# EAGLE design 549-teletouch (EAGLE 8.0.0)
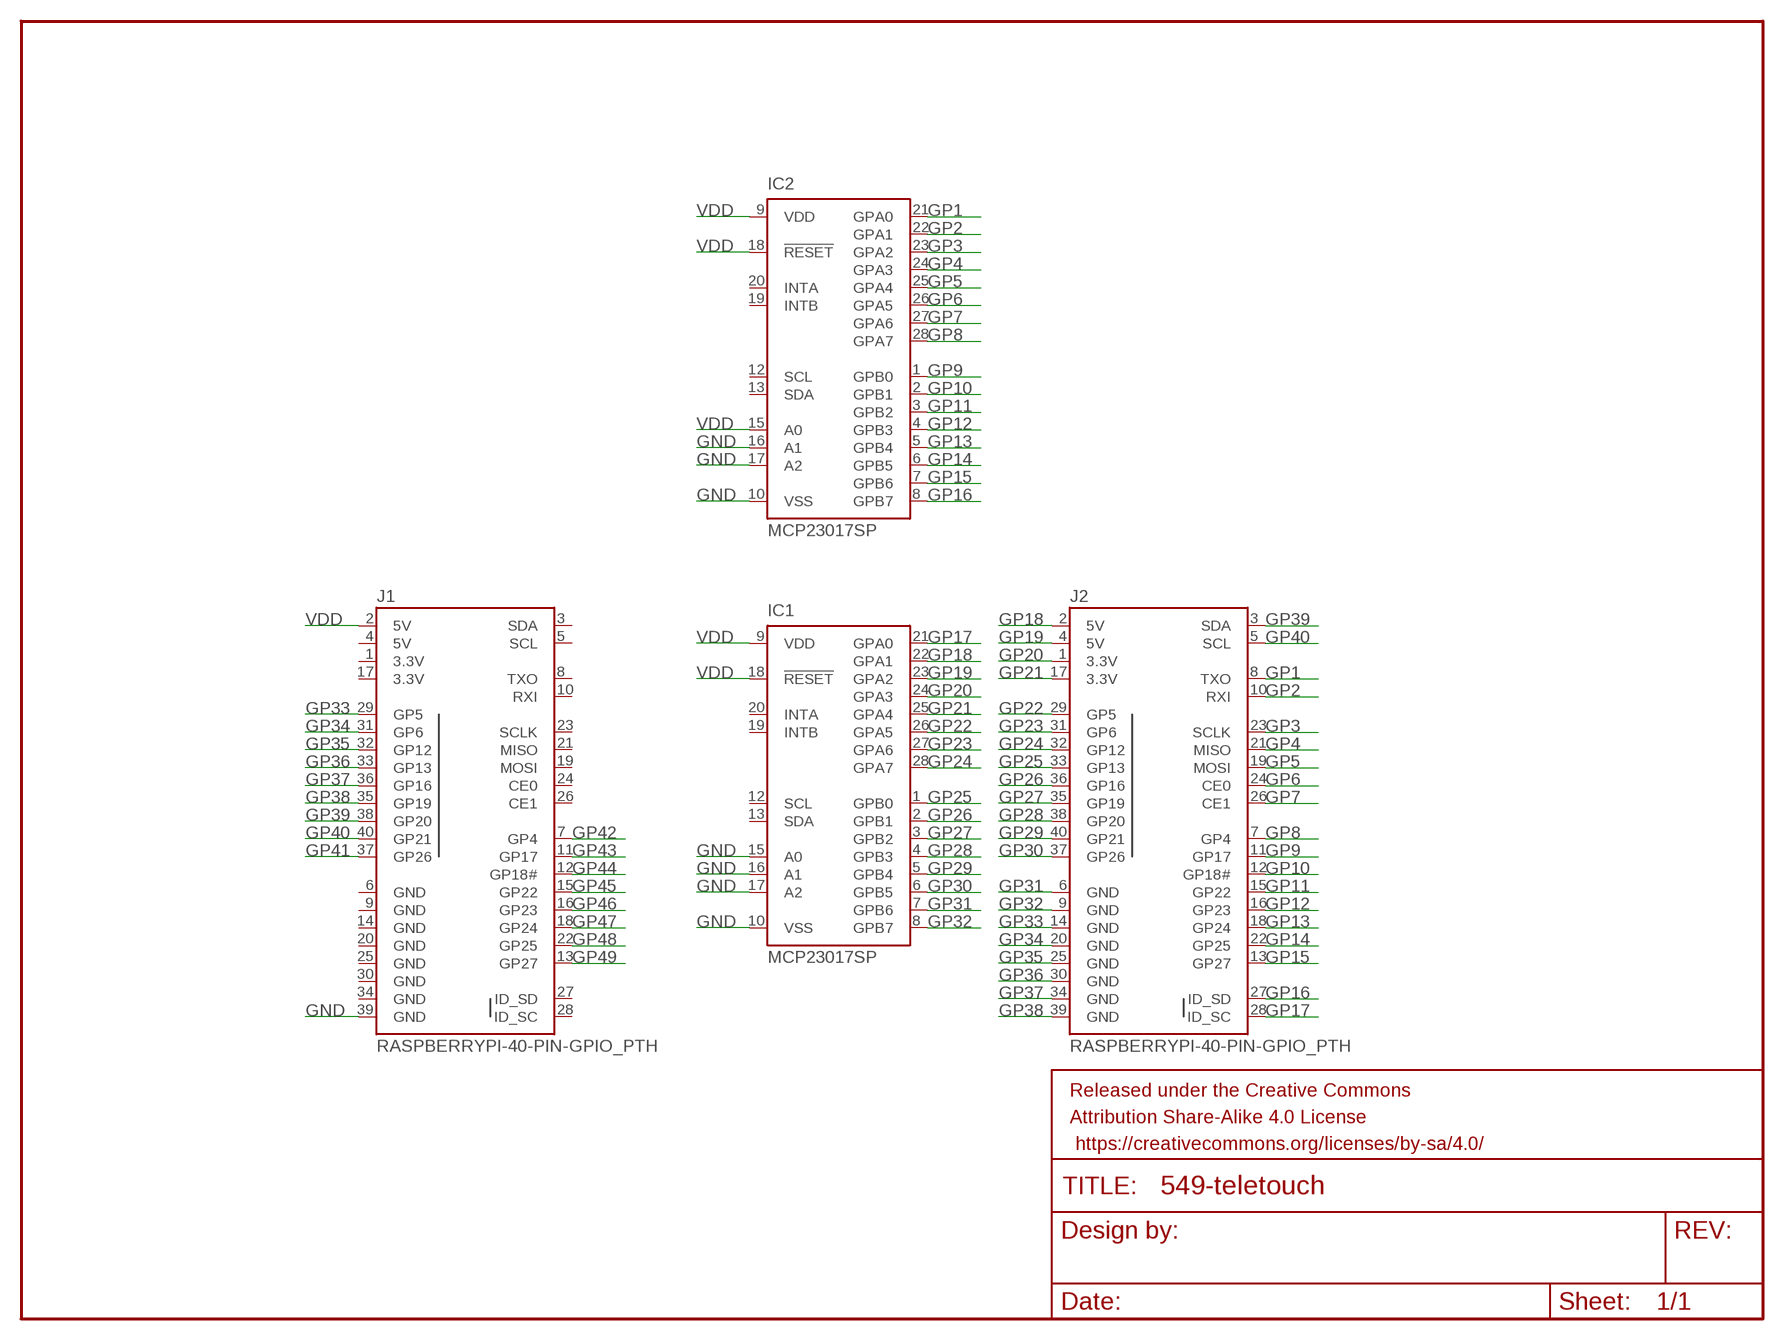
[diagram p0: schematic, sheet 1]

## Parts
FRAME1  FRAME-LETTER  [CREATIVE_COMMONS]
IC1  MCP23017SP  [DIL28-3]
IC2  MCP23017SP  [DIL28-3]
J1  RASPBERRYPI-40-PIN-GPIO_PTH  [2X20_SHROUDED]
J2  RASPBERRYPI-40-PIN-GPIO_PTH  [2X20_SHROUDED]

## Nets
GND: IC1.10(VSS) IC1.15(A0) IC1.16(A1) IC1.17(A2) IC2.10(VSS) IC2.16(A1) IC2.17(A2) J1.39(GND)
GP1: IC2.21(GPA0) J2.8(TXO)
GP2: IC2.22(GPA1) J2.10(RXI)
GP3: IC2.23(GPA2) J2.23(SCLK)
GP4: IC2.24(GPA3) J2.21(MISO)
GP5: IC2.25(GPA4) J2.19(MOSI)
GP6: IC2.26(GPA5) J2.24(CE0)
GP7: IC2.27(GPA6) J2.26(CE1)
GP8: IC2.28(GPA7) J2.7(GP4)
GP9: IC2.1(GPB0) J2.11(GP17)
GP10: IC2.2(GPB1) J2.12(GP18#)
GP11: IC2.3(GPB2) J2.15(GP22)
GP12: IC2.4(GPB3) J2.16(GP23)
GP13: IC2.5(GPB4) J2.18(GP24)
GP14: IC2.6(GPB5) J2.22(GP25)
GP15: IC2.7(GPB6) J2.13(GP27)
GP16: IC2.8(GPB7) J2.27(ID_SD)
GP17: IC1.21(GPA0) J2.28(ID_SC)
GP18: IC1.22(GPA1) J2.2(5V)
GP19: IC1.23(GPA2) J2.4(5V)
GP20: IC1.24(GPA3) J2.1(3.3V)
GP21: IC1.25(GPA4) J2.17(3.3V)
GP22: IC1.26(GPA5) J2.29(GP5)
GP23: IC1.27(GPA6) J2.31(GP6)
GP24: IC1.28(GPA7) J2.32(GP12)
GP25: IC1.1(GPB0) J2.33(GP13)
GP26: IC1.2(GPB1) J2.36(GP16)
GP27: IC1.3(GPB2) J2.35(GP19)
GP28: IC1.4(GPB3) J2.38(GP20)
GP29: IC1.5(GPB4) J2.40(GP21)
GP30: IC1.6(GPB5) J2.37(GP26)
GP31: IC1.7(GPB6) J2.6(GND)
GP32: IC1.8(GPB7) J2.9(GND)
GP33: J1.29(GP5) J2.14(GND)
GP34: J1.31(GP6) J2.20(GND)
GP35: J1.32(GP12) J2.25(GND)
GP36: J1.33(GP13) J2.30(GND)
GP37: J1.36(GP16) J2.34(GND)
GP38: J1.35(GP19) J2.39(GND)
GP39: J1.38(GP20) J2.3(SDA)
GP40: J1.40(GP21) J2.5(SCL)
GP41: J1.37(GP26)
GP42: J1.7(GP4)
GP43: J1.11(GP17)
GP44: J1.12(GP18#)
GP45: J1.15(GP22)
GP46: J1.16(GP23)
GP47: J1.18(GP24)
GP48: J1.22(GP25)
GP49: J1.13(GP27)
VDD: IC1.9(VDD) IC1.18(!RESET) IC2.9(VDD) IC2.15(A0) IC2.18(!RESET) J1.2(5V)
Unconnected: IC1.12(SCL) IC1.13(SDA) IC1.19(INTB) IC1.20(INTA) IC2.12(SCL) IC2.13(SDA) IC2.19(INTB) IC2.20(INTA) J1.3(SDA) J1.5(SCL) J1.8(TXO) J1.10(RXI) J1.19(MOSI) J1.21(MISO) J1.23(SCLK) J1.24(CE0) J1.26(CE1) J1.27(ID_SD) J1.28(ID_SC)

## Power pins joined to a net without a drawn wire
3.3V: J1.1(3.3V) J1.17(3.3V)
5V: J1.4(5V)
GND: J1.6(GND) J1.9(GND) J1.14(GND) J1.20(GND) J1.25(GND) J1.30(GND) J1.34(GND)

## Library data of the parts
FRAME1 = SparkFun-Aesthetics:FRAME-LETTER: Schematic Frame - Letter Standard 8.5x11 US Letter frame
IC1 IC2 = microchip:MCP23017: http://ww1.microchip.com/downloads/en/DeviceDoc/21952a.pdf Source: http://ww1.microchip.com/downloads/en/DeviceDoc/21952a.pdf; MF: MICROCHIP; MPN: MCP23017-E/SP; OC_FARNELL: 1332088; OC_NEWARK: 31K2959
J1 J2 = SparkFun-Connectors:RASPBERRYPI-40-PIN-GPIO: Raspberry Pi GPIO Header 2x20 pin connector, as found on B, B+, A+ models. Both shrouded PTH and SMT versions available. SparkFun Products: GPIO Shrouded Header <https://www.sparkfun.com/products/13054>- PTH SparkFun Pi Wedge (Preassembled) <https://www.sparkfun.com/products/13717>; PROD_ID: CONN-12263; SF_ID: PRT-13054

## Board
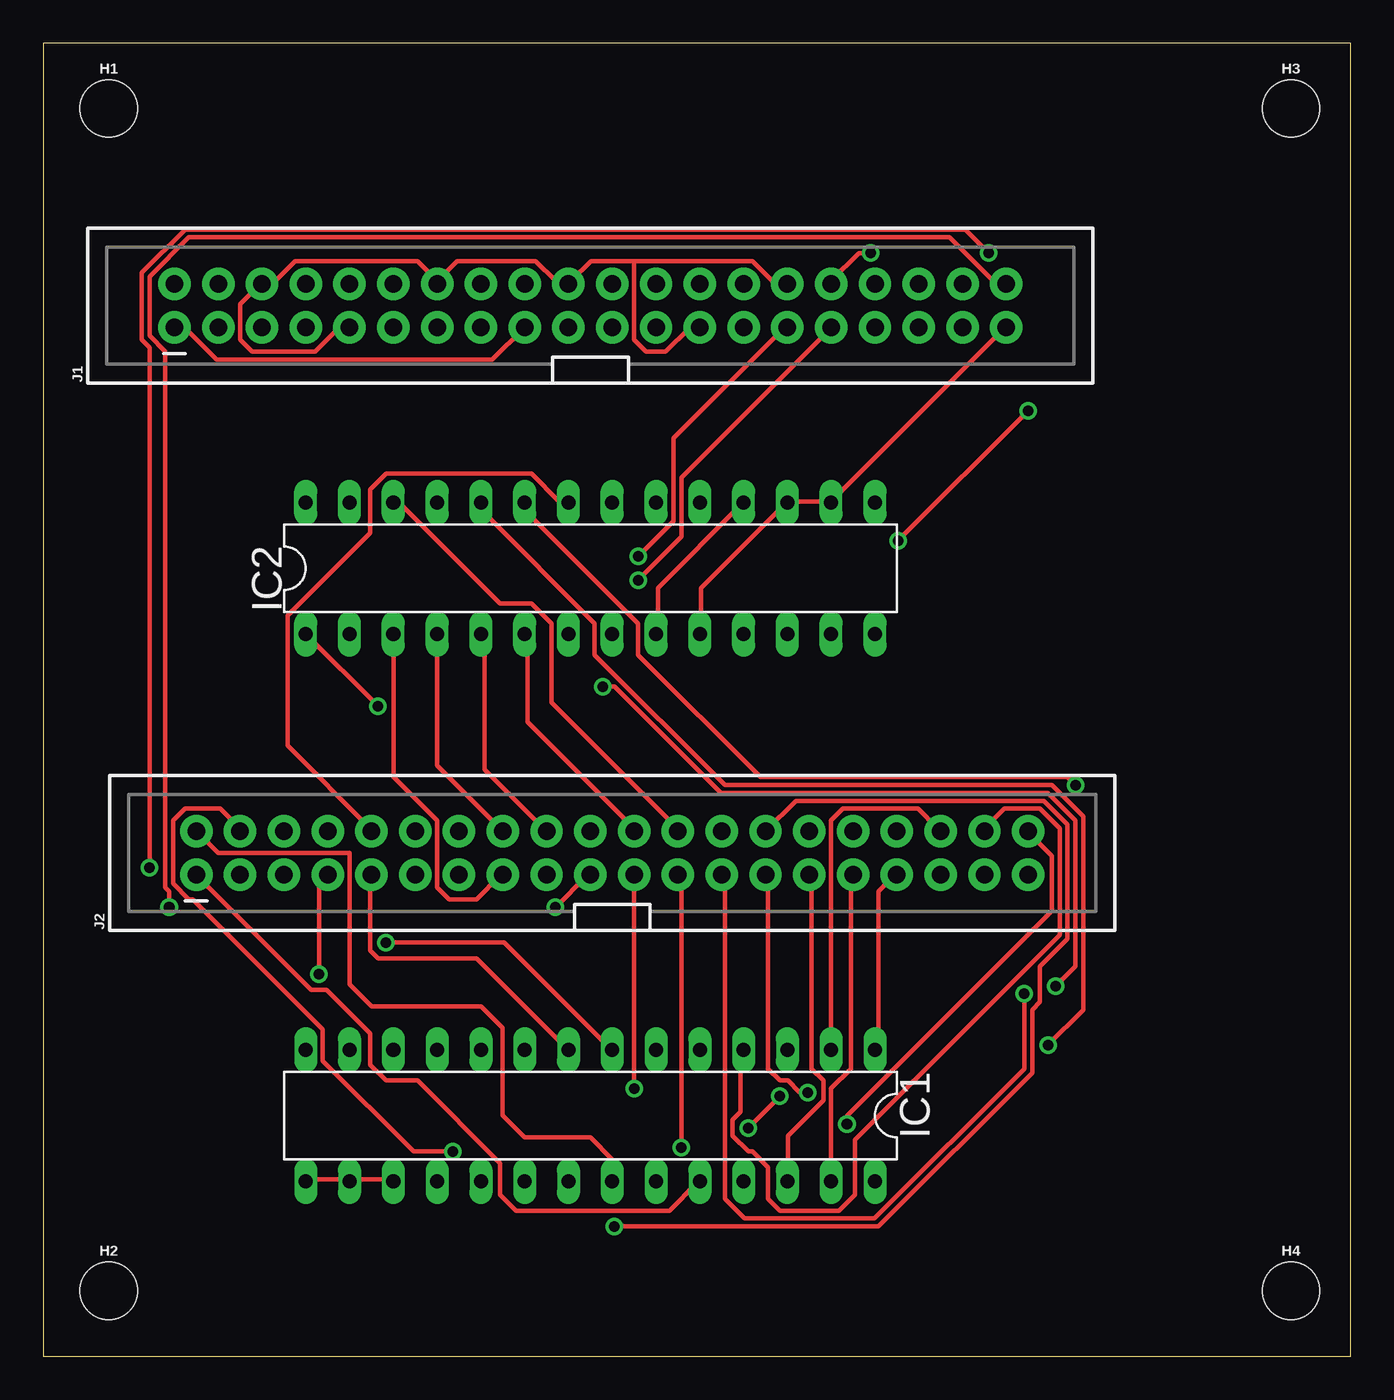
[diagram p1: board, top side]
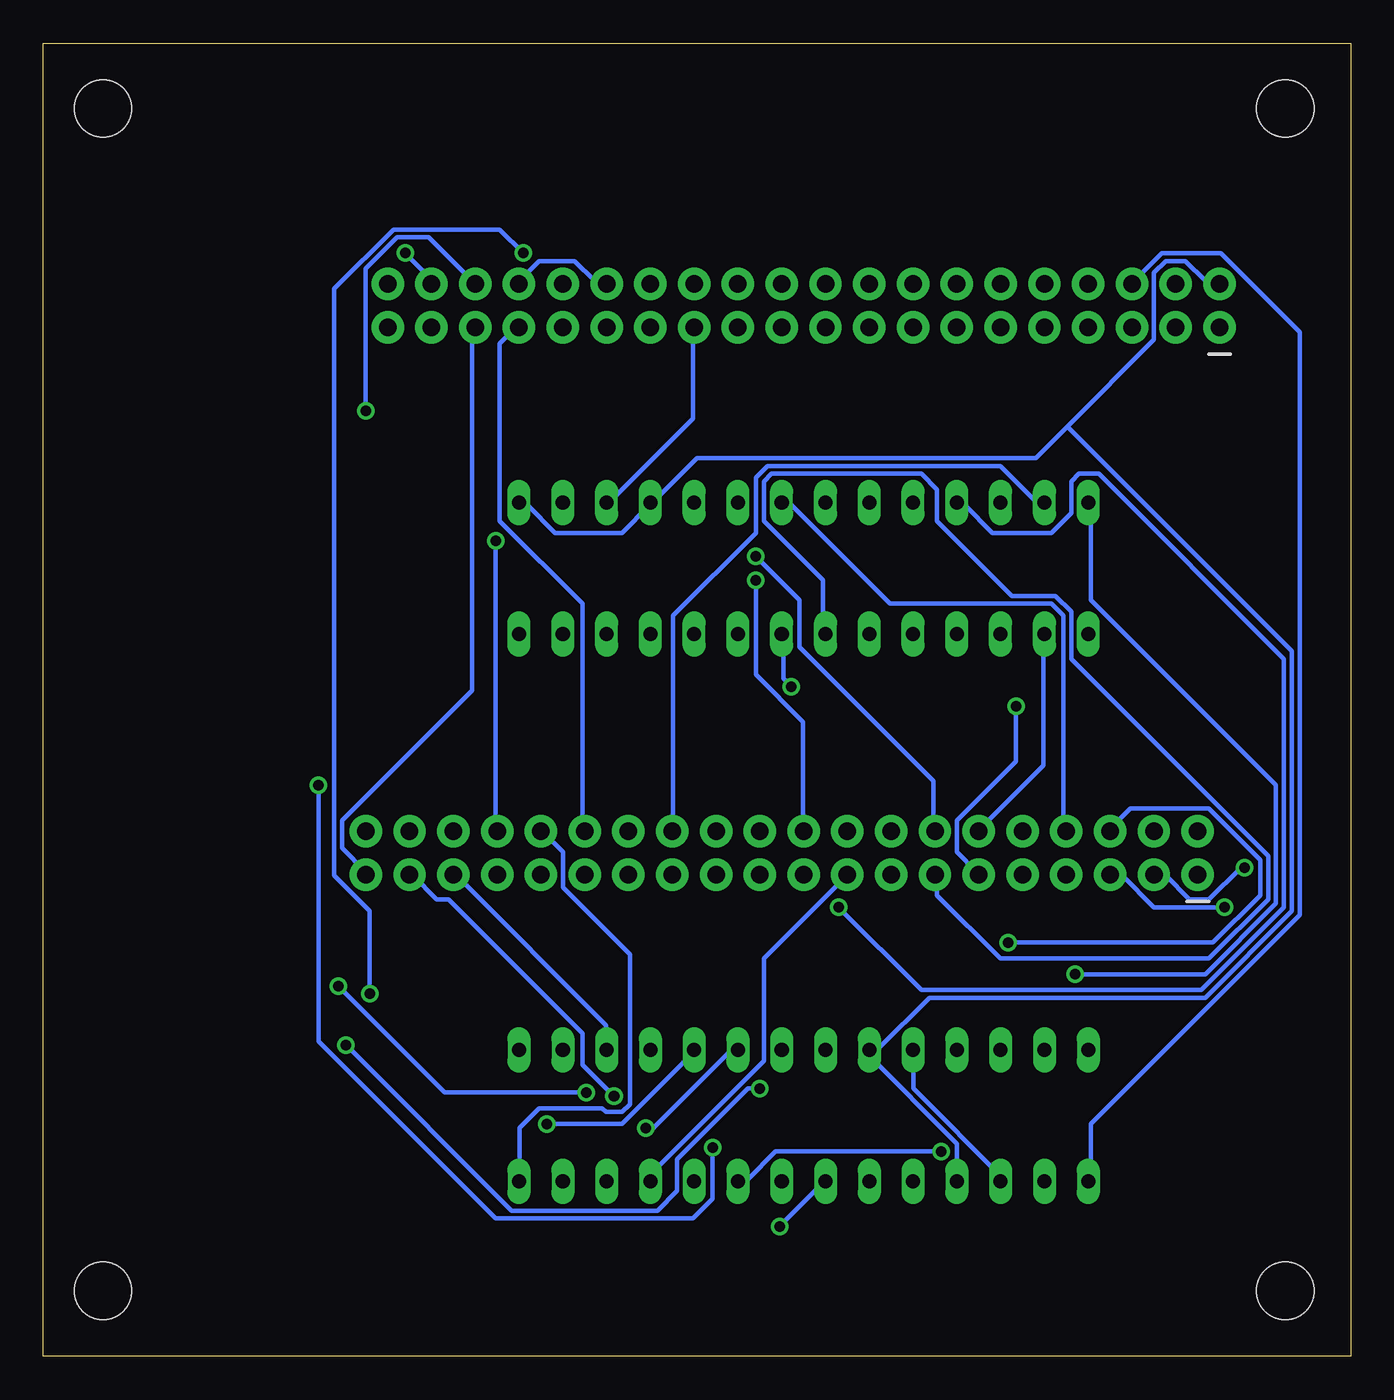
[diagram p2: board, bottom side, seen from below]

Size 75.87 x 76.19 mm. Coordinates in mm from the lower left corner, seen from the top.
Outline: 0,0 75.87,0 75.87,76.19 0,76.19 0,0
Copper layers (1*16): Top 0.035mm / dielectric 1.5mm / Bottom 0.035mm
Design rules "default": minimum track width 10mil, minimum drill 24mil, track to track 8mil, track to pad 8mil, pad to pad 8mil, via to via 8mil, smd to smd 8mil, copper to edge 40mil, drill to drill 8mil, minimum pad ring 10mil, minimum via ring 8mil, stop-mask expansion 4mil, vias tented up to drill 0mil, thermal gap 10mil

### Footprints (pad centres in the part's own frame; a part is rotated, then mirrored left to right if it is on the bottom)
STAND-OFF = hole 3.302: 0,0
DIL28-3 = drill 0.813 long: 1 -16.51,-3.81; 2 -13.97,-3.81; 3 -11.43,-3.81; 4 -8.89,-3.81; 5 -6.35,-3.81; 6 -3.81,-3.81; 7 -1.27,-3.81; 8 1.27,-3.81; 9 3.81,-3.81; 10 6.35,-3.81; 11 8.89,-3.81; 12 11.43,-3.81; 13 13.97,-3.81; 14 16.51,-3.81; 15 16.51,3.81; 16 13.97,3.81; 17 11.43,3.81; 18 8.89,3.81; 19 6.35,3.81; 20 3.81,3.81; 21 1.27,3.81; 22 -1.27,3.81; 23 -3.81,3.81; 24 -6.35,3.81; 25 -8.89,3.81; 26 -11.43,3.81; 27 -13.97,3.81; 28 -16.51,3.81
2X20_SHROUDED = drill 1.016 pad 1.88: 1 -1.27,24.13; 2 1.27,24.13; 3 -1.27,21.59; 4 1.27,21.59; 5 -1.27,19.05; 6 1.27,19.05; 7 -1.27,16.51; 8 1.27,16.51; 9 -1.27,13.97; 10 1.27,13.97; 11 -1.27,11.43; 12 1.27,11.43; 13 -1.27,8.89; 14 1.27,8.89; 15 -1.27,6.35; 16 1.27,6.35; 17 -1.27,3.81; 18 1.27,3.81; 19 -1.27,1.27; 20 1.27,1.27; 21 -1.27,-1.27; 22 1.27,-1.27; 23 -1.27,-3.81; 24 1.27,-3.81; 25 -1.27,-6.35; 26 1.27,-6.35; 27 -1.27,-8.89; 28 1.27,-8.89; 29 -1.27,-11.43; 30 1.27,-11.43; 31 -1.27,-13.97; 32 1.27,-13.97; 33 -1.27,-16.51; 34 1.27,-16.51; 35 -1.27,-19.05; 36 1.27,-19.05; 37 -1.27,-21.59; 38 1.27,-21.59; 39 -1.27,-24.13; 40 1.27,-24.13

### Placement (x,y rotation side)
FRAME1  -101.6,88.9 0 top  (outside the outline)
H1  STAND-OFF  [STAND-OFF]  3.81,72.39 0 top
H2  STAND-OFF  [STAND-OFF]  3.81,3.81 0 top
H3  STAND-OFF  [STAND-OFF]  72.39,72.39 0 top
H4  STAND-OFF  [STAND-OFF]  72.39,3.81 0 top
IC1  31.75,13.97 180 top
IC2  31.75,45.72 0 top
J1  31.75,60.96 90 top
J2  33.02,29.21 90 top

### Tracks (layer width: path | path; a pad name or v marks a point on that pad's centre or on a via)
3.3V
  Top 0.254: J1.1 7.77,59.66 8.23,59.66 10.06,57.84 26.06,57.84 27.89,59.66 J1.17
GND
  Top 0.254: IC2.10 38.18,42.06 38.18,44.58 42.98,49.38 IC2.17 43.2,49.61 45.72,49.61 | 45.72,49.61 55.78,59.66 J1.39 | 45.72,49.61 IC2.16 | IC1.15 15.32,10.29 17.6,10.29 IC1.16 17.83,10.29 20.12,10.29 IC1.17 | 22.86,62.41 21.72,63.55 14.63,63.55 13.49,62.41 12.8,62.41 J1.6 12.57,62.18 11.43,61.04 11.43,58.98 12.12,58.29 15.77,58.29 17.14,59.66 17.6,59.66 J1.9 | 22.86,62.41 24,63.55 28.57,63.55 29.72,62.41 30.4,62.41 J1.20 30.63,62.41 31.77,63.55 34.29,63.55 | 22.86,62.41 J1.14 | 34.29,63.55 41.15,63.55 42.29,62.41 42.98,62.41 J1.30 | 34.29,63.55 34.29,58.98 34.98,58.29 36.12,58.29 37.49,59.66 37.95,59.66 J1.25
  Bottom 0.254: J1.25 38.18,59.66 38.18,54.41 42.98,49.61 IC2.17 | IC1.10 25.38,17.6 25.38,15.54 20.12,10.29 IC1.17 | J1.30 43.2,62.41 43.89,62.41 45.03,63.55 47.09,63.55 48.23,62.41 J1.34 | IC1.15 15.09,10.29 15.09,13.49 2.97,25.6 2.97,59.44 7.54,64.01 10.97,64.01 12.57,62.41 J1.6
GP1
  Bottom 0.254: IC2.21 32.92,49.38 32.46,49.38 26.75,43.66 17.37,43.66 16.69,42.98 16.69,30.63 J2.8
GP2
  Top 0.254: IC2.22 30.4,49.61 29.95,49.61 28.35,51.21 19.89,51.21 18.97,50.29 18.97,47.78 14.17,42.98 14.17,35.43 18.97,30.63 J2.10
GP3  (via drill 0.61)
  Top 0.254: v59.89,33.15 59.44,33.6 41.6,33.6 34.52,40.69 34.52,42.52 28.12,48.92 28.12,49.38 IC2.23 | v37.03,12.12 37.03,27.89 J2.23
  Bottom 0.254: v59.89,33.15 59.89,18.29 49.61,8 38.18,8 37.03,9.14 v37.03,12.12
GP4  (via drill 0.61)
  Top 0.254: v58.29,18.06 60.35,20.12 60.35,31.32 58.52,33.15 39.55,33.15 32,40.69 32,42.52 25.6,48.92 25.6,49.38 IC2.24 | J2.21 v34.29,15.54
  Bottom 0.254: v58.29,18.06 48.69,8.46 40.23,8.46 39.09,9.6 39.09,11.43 34.98,15.54 v34.29,15.54
GP5  (via drill 0.61)
  Top 0.254: v29.72,26.06 31.55,27.89 J2.19
  Bottom 0.254: v29.72,26.06 24.92,21.26 8.69,21.26 3.89,26.06 3.89,40.46 14.63,51.21 15.77,51.21 16.23,50.75 16.23,48.92 17.37,47.78 20.8,47.78 22.4,49.38 22.86,49.38 IC2.25
GP6
  Top 0.254: IC2.26 20.34,49.38 20.8,49.38 26.52,43.66 28.35,43.66 29.49,42.52 29.49,37.95 36.8,30.63 J2.24
GP7
  Bottom 0.254: IC2.27 17.83,49.61 18.29,49.61 20.34,51.66 33.83,51.66 34.52,50.98 34.52,47.78 39.32,42.98 39.32,30.63 J2.26
GP8  (via drill 0.61)
  Top 0.254: v16,22.17 16,27.43 J2.7
  Bottom 0.254: v16,22.17 8.46,22.17 4.34,26.29 4.34,33.15 15.09,43.89 15.09,49.38 IC2.28
GP9  (via drill 0.61)
  Top 0.254: v19.43,37.72 IC2.1
  Bottom 0.254: v19.43,37.72 19.43,34.52 22.86,31.09 22.86,29.26 21.72,28.12 J2.11
GP10
  Bottom 0.254: IC2.2 17.83,41.83 17.83,34.29 21.49,30.63 J2.12
GP11
  Top 0.254: IC2.3 20.34,41.83 20.34,33.6 22.86,31.09 22.86,27.2 23.55,26.52 25.15,26.52 26.52,27.89 J2.15
GP12
  Top 0.254: IC2.4 22.86,34.29 J2.16
GP13
  Top 0.254: IC2.5 25.6,41.83 25.6,34.06 29.03,30.63 J2.18
GP14
  Top 0.254: IC2.6 28.12,41.83 28.12,36.8 34.29,30.63 J2.22
GP15
  Bottom 0.254: IC2.7 30.63,42.06 30.63,45.03 34.06,48.46 34.06,50.75 33.6,51.21 24.92,51.21 24,50.29 24,48.46 19.66,44.12 17.14,44.12 16.23,43.2 16.23,40.46 4.8,29.03 4.8,26.52 8.23,23.09 20.34,23.09 24,26.75 24,27.89 J2.13
GP16  (via drill 0.61)
  Top 0.254: v32.46,38.86 33.15,38.86 39.32,32.69 58.29,32.69 59.89,31.09 59.89,22.63 v58.75,21.49 | v44.35,15.32 43.89,15.32 43.2,16 42.75,16 42.06,16.69 42.06,27.89 J2.27
  Bottom 0.254: v32.46,38.86 32.92,39.32 32.92,41.83 IC2.8 | v58.75,21.49 52.58,15.32 v44.35,15.32
GP17  (via drill 0.61)
  Top 0.254: v33.15,7.54 48.46,7.54 57.38,16.46 57.38,20.12 57.84,20.57 57.84,22.63 59.44,24.23 59.44,30.86 58.06,32.23 43.66,32.23 J2.28
  Bottom 0.254: v33.15,7.54 30.63,10.06 IC1.21
GP18
  Top 0.254: J2.2 10.16,29.21 17.78,29.21 17.78,21.59 19.05,20.32 25.4,20.32 26.67,19.05 26.67,13.97 27.94,12.7 31.75,12.7 33.02,11.43 IC1.22
GP19  (via drill 0.61)
  Top 0.254: v23.77,11.89 21.49,11.89 16.23,17.14 16.23,18.97 8.69,26.52 8.46,26.52 7.54,27.43 7.54,31.09 8.23,31.77 10.29,31.77 11.43,30.63 J2.4
  Bottom 0.254: v23.77,11.89 33.38,11.89 34.98,10.29 35.43,10.29 IC1.23
GP20
  Top 0.254: IC1.24 37.95,10.06 36.35,8.46 27.43,8.46 26.52,9.37 26.52,11.2 21.72,16 19.89,16 18.97,16.92 18.97,18.75 16.46,21.26 15.54,21.26 8.91,27.89 J2.1
GP21
  Bottom 0.254: J2.17 34.06,23.09 34.06,17.14 40.46,10.74 40.46,10.29 IC1.25
GP22
  Top 0.254: IC1.26 43.2,10.29 43.2,12.8 45.26,14.86 45.26,16 44.58,16.69 44.58,27.89 J2.29
GP23
  Top 0.254: IC1.27 45.72,15.54 46.86,16.69 46.86,27.89 J2.31
GP24
  Bottom 0.254: IC1.28 48.23,10.29 48.23,13.26 47.09,14.4 43.43,14.4 43.2,14.17 42.29,14.17 41.83,14.63 41.83,23.32 45.72,27.2 45.72,29.26 46.86,30.4 J2.32
GP25
  Top 0.254: IC1.1 48.46,17.83 48.46,26.98 49.38,27.89 J2.33
GP26
  Top 0.254: IC1.2 45.72,31.09 46.41,31.77 50.75,31.77 51.89,30.63 J2.36
GP27
  Bottom 0.254: IC1.3 43.2,17.83 43.2,19.2 51.89,27.89 J2.35
GP28
  Top 0.254: IC1.4 40.46,17.6 40.46,14.17 40.01,13.72 40.01,12.8 40.92,11.89 41.15,11.89 42.06,10.97 42.06,9.14 42.75,8.46 46.18,8.46 47.09,9.37 47.09,12.57 58.98,24.46 58.98,30.63 57.84,31.77 55.78,31.77 54.63,30.63 J2.38
GP29  (via drill 0.61)
  Top 0.254: v46.63,13.49 46.63,13.95 58.52,25.83 58.52,29.03 57.15,30.4 J2.40
  Bottom 0.254: v46.63,13.49 42.29,13.49 38.18,17.6 IC1.5
GP30  (via drill 0.61)
  Top 0.254: v42.75,15.09 v40.92,13.26
  Bottom 0.254: v40.92,13.26 40.46,13.26 36.12,17.6 35.66,17.6 IC1.6 | v42.75,15.09 44.58,16.92 44.58,18.75 52.35,26.52 53.03,26.52 54.41,27.89 J2.37
GP31  (via drill 0.61)
  Top 0.254: v19.89,24 26.75,24 32.92,17.83 IC1.7
  Bottom 0.254: v19.89,24 8,24 5.26,26.75 5.26,28.8 8.23,31.77 12.8,31.77 13.95,30.63 J2.6
GP32
  Top 0.254: IC1.8 30.4,17.83 25.15,23.09 19.43,23.09 18.97,23.55 18.97,27.89 J2.9
GP33  (via drill 0.61)
  Top 0.254: v34.52,46.41 36.58,48.46 36.58,53.26 42.98,59.66 J1.29
  Bottom 0.254: v34.52,46.41 32,43.89 32,41.15 24.23,33.38 24.23,30.63 J2.14
GP34  (via drill 0.61)
  Top 0.254: v34.52,45.03 37.03,47.55 37.03,50.98 45.72,59.66 J1.31
  Bottom 0.254: v34.52,45.03 34.52,39.55 31.77,36.8 31.77,30.63 J2.20
GP35  (via drill 0.61)
  Top 0.254: v56.92,21.03 56.92,16.69 48.23,8 40.69,8 39.55,9.14 39.55,27.89 J2.25 | v48.01,64.01 47.32,64.01 45.72,62.41 J1.32
  Bottom 0.254: v56.92,21.03 56.92,25.83 58.98,27.89 58.98,61.95 55.55,65.38 49.38,65.38 v48.01,64.01
GP36
  Bottom 0.254: J2.30 44.58,30.63 44.58,43.66 49.38,48.46 49.38,58.75 48.46,59.66 J1.33
GP37  (via drill 0.61)
  Top 0.254: v57.15,54.86 v49.61,47.32
  Bottom 0.254: v49.61,47.32 49.61,30.63 J2.34 | v57.15,54.86 57.15,63.09 55.32,64.92 53.49,64.92 J1.36
GP38
  Bottom 0.254: J1.35 50.98,59.66 50.98,38.63 58.52,31.09 58.52,29.49 57.15,28.12 J2.39
GP39  (via drill 0.61)
  Top 0.254: v6.17,28.35 6.17,58.52 5.71,58.98 5.71,62.87 8.23,65.38 53.49,65.38 v54.86,64.01
  Bottom 0.254: v6.17,28.35 6.4,28.35 8.23,26.52 9.37,26.52 10.74,27.89 11.43,27.89 J2.3 | v54.86,64.01 53.26,62.41 J1.38
GP40  (via drill 0.61)
  Top 0.254: v7.32,26.06 7.32,26.98 7.09,27.2 7.09,58.29 6.17,59.21 6.17,62.64 8.46,64.92 52.58,64.92 55.09,62.41 55.78,62.41 J1.40
  Bottom 0.254: v7.32,26.06 11.43,26.06 13.26,27.89 13.95,27.89 J2.5
VDD
  Top 0.254: IC2.9 35.66,42.06 35.66,44.58 40.46,49.38 IC2.18
  Bottom 0.254: IC1.18 22.86,12.34 28.12,17.6 IC1.9 27.89,17.83 27.43,17.83 24.46,20.8 8.46,20.8 3.43,25.83 3.43,40.92 16.46,53.95 | IC2.15 48.23,49.38 47.78,49.38 46.18,47.78 42.29,47.78 40.69,49.38 IC2.18 40.46,49.61 37.95,52.12 18.29,52.12 16.46,53.95 | 16.46,53.95 11.43,58.98 11.43,62.87 10.74,63.55 9.6,63.55 8.46,62.41 7.77,62.41 J1.2